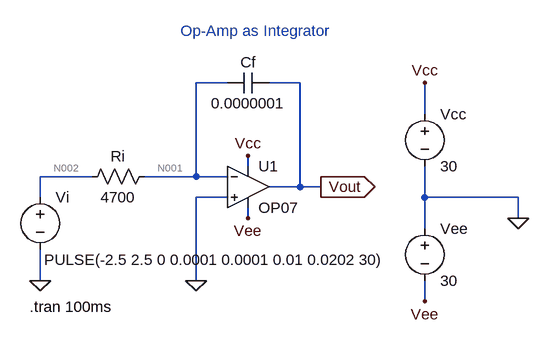
[diagram p0: schematic Assignment 9(i).asc]
Assignment 9(i).asc, the LTspice schematic file:
Version 4.1
SHEET 1 880 680
WIRE 160 -16 112 -16
WIRE 272 -16 224 -16
WIRE 464 32 464 -16
WIRE 192 112 192 96
WIRE -48 128 -128 128
WIRE 112 128 112 -16
WIRE 112 128 32 128
WIRE 160 128 112 128
WIRE 272 144 272 -16
WIRE 272 144 224 144
WIRE 304 144 272 144
WIRE -128 160 -128 128
WIRE 160 160 112 160
WIRE 464 160 464 112
WIRE 608 160 464 160
WIRE 192 192 192 176
WIRE 608 192 608 160
WIRE 464 208 464 160
WIRE -128 288 -128 240
WIRE 112 288 112 160
WIRE 464 320 464 288
FLAG -128 288 0
FLAG 112 288 0
FLAG 304 144 Vout
IOPIN 304 144 Out
FLAG 608 192 0
FLAG 464 -16 Vcc
FLAG 192 96 Vcc
FLAG 464 320 Vee
FLAG 192 192 Vee
SYMBOL Opamps\\OP07 192 80 R0
SYMATTR InstName U1
SYMBOL voltage 464 16 R0
WINDOW 123 0 0 Left 2
WINDOW 39 0 0 Left 2
SYMATTR InstName Vcc
SYMATTR Value 30
SYMBOL voltage 464 192 R0
WINDOW 123 0 0 Left 2
WINDOW 39 0 0 Left 2
SYMATTR InstName Vee
SYMATTR Value 30
SYMBOL voltage -128 144 R0
WINDOW 3 6 112 Left 2
WINDOW 123 0 0 Left 2
WINDOW 39 0 0 Left 2
SYMATTR Value PULSE(-2.5 2.5 0 0.0001 0.0001 0.01 0.0202 30)
SYMATTR InstName Vi
SYMBOL cap 224 -32 R90
WINDOW 0 0 32 VBottom 2
WINDOW 3 32 32 VTop 2
SYMATTR InstName Cf
SYMATTR Value 0.0000001
SYMBOL res 48 112 R90
WINDOW 0 0 56 VBottom 2
WINDOW 3 32 56 VTop 2
SYMATTR InstName Ri
SYMATTR Value 4700
TEXT 88 -96 Left 2 ;Op-Amp as Integrator
TEXT -144 328 Left 2 !.tran 100ms

The netlist it stands for:
* Assignment 9(i).asc
X§U1 0 N001 Vcc Vee Vout LT1001  ; OP07, pins In+ In- V+ V- OUT
Vcc Vcc 0 30
Vee 0 Vee 30
Vi N002 0 PULSE(-2.5 2.5 0 0.0001 0.0001 0.01 0.0202 30)
Cf Vout N001 0.0000001
Ri N001 N002 4700
* Op-Amp as Integrator
.tran 100ms
.lib LTC.lib
.backanno
.end

* Results of the author's LTspice run, read from the files saved beside the schematic
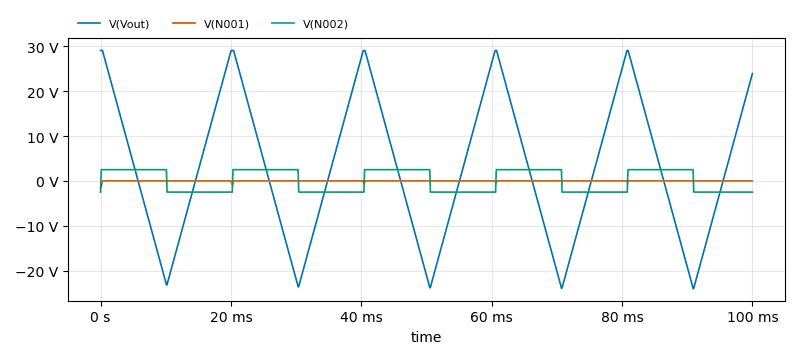
[diagram p1: Transient Analysis of Assignment 9(i).asc, plotted from the saved traces]
* Transient Analysis, 1 run:
*   V(Vout): min -24.06 V, max 29.1 V, average 2.722 V, rms 19.86 V, last 23.93 V
*   V(N001): min -1.646 V, max 10.26 mV, average -6.444 mV, rms 71.09 mV, last -1.028 mV
*   V(N002): min -2.5 V, max 2.5 V, average 25 mV, rms 2.493 V, last -2.5 V